# Altium project WoodStove.PrjPCB (part 4 of 4)

## Sheet JTAG.SchDoc
size Letter
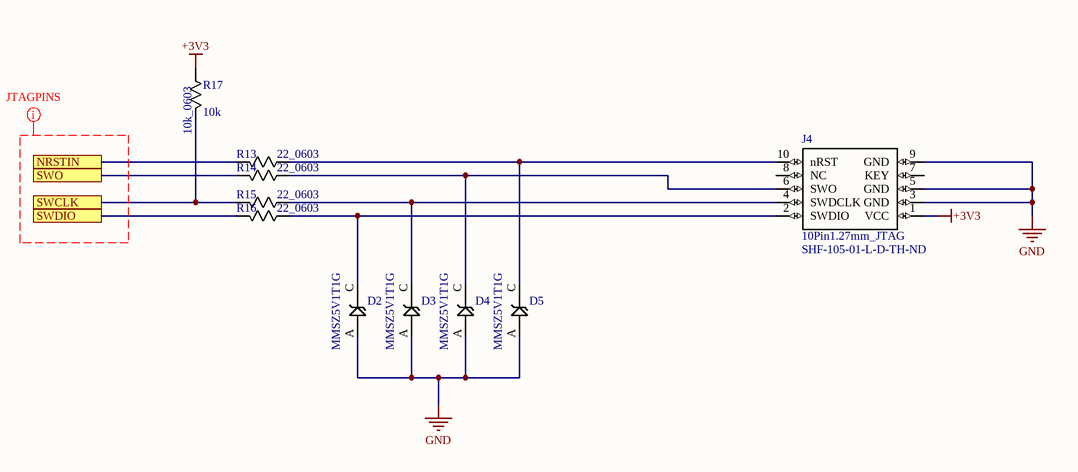
[diagram p9: JTAG.SchDoc]

### Parts
D2  MMSZ5V1T1G  [SOIC127P370X94-2N]
D3  MMSZ5V1T1G  [SOIC127P370X94-2N]
D4  MMSZ5V1T1G  [SOIC127P370X94-2N]
D5  MMSZ5V1T1G  [SOIC127P370X94-2N]
J4  10Pin1.27mm_JTAG  Supplier Part Number 1: SHF-105-01-L-D-TH-ND  [10Pin1.27mm]
R13  22_0603  [0603]
R14  22_0603  [0603]
R15  22_0603  [0603]
R16  22_0603  [0603]
R17  10k_0603  Resistance: 10k  [0603]

### Ports
NRSTIN, SWCLK, SWDIO, SWO

### Nets
+3V3: J4.1(VCC) R17.2
GND: D2.A D3.A D4.A D5.A J4.3(GND) J4.5(GND) J4.9(GND)
RSTNET: R13.1 ; port NRSTIN
NetD2_C: D2.C J4.2(SWDIO) R16.2
NetD3_C: D3.C J4.4(SWDCLK) R15.2
NetD4_C: D4.C J4.6(SWO) R14.2
NetD5_C: D5.C J4.10(nRST) R13.2
NetR14_1: R14.1 ; port SWO
NetR15_1: R15.1 R17.1 ; port SWCLK
NetR16_1: R16.1 ; port SWDIO

Not connected (* = marked no-connect by the designer): J4 7(KEY) 8(NC)

### Layout directives
net class JTAGNETS: (no net found under the mark)

### Library data of the parts
D2-D5 = MMSZ5V1T1G: DIODE Zener 5.1V 500mw; Manufacturer: ON Semiconductor; Material: Plastic; Tolerance: 5%; Impedance: 60R; Max Reverse Leakage Current: 2uA; Test Current: 5mA; Element Configuration: Single; Forward Voltage: 900mV; Zener Current: 10mA; Breakdown Voltage: 5.36V; Supplier 1: Future Electronics; Manufacturer Part Number: MMSZ5V1T1G; Stock 1: 0; Case/Package: SOD-123-2; Number of Pins: 2; Min Operating Temperature: -55°C; Max Operating Temperature: 150°C; Package Quantity: 1; Max Power Dissipation: 500mW; Packaging: Tape and Reel; Zener Voltage: 5.1V; Power Dissipation: 500mW; Voltage Tolerance: 5%; Working Voltage: 5.1V; Peak Reverse Current: 2uA; Voltage Rating (DC): 5.1V; Power Rating: 500mW; Length: 2.69mm; Height: 1.12mm; Width: 1.6mm; Radiation Hardening: No; Lead Free: Lead Free; REACH SVHC: No SVHC; ComponentLink1URL: https://datasheet.ciiva.com/895/mmsz2v4t1-d-895025.pdf; ComponentLink1Description: https://datasheet.ciiva.com/895/mmsz2v4t1-d-895025.pdf; ComponentLink2URL: https://datasheet.ciiva.com/895/mmsz2v4t1-d-895026.pdf; ComponentLink2Description: https://datasheet.ciiva.com/895/mmsz2v4t1-d-895026.pdf; ComponentLink3URL: https://datasheet.ciiva.com/895/mmsz2v4t1-d-895027.pdf; ComponentLink3Description: https://datasheet.ciiva.com/895/mmsz2v4t1-d-895027.pdf; ComponentLink4URL: https://datasheet.ciiva.com/15142/getdatasheetpartid-72078-15142387.pdf; ComponentLink4Description: https://datasheet.ciiva.com/15142/getdatasheetpartid-72078-15142387.pdf; ComponentLink5URL: https://datasheet.ciiva.com/8346/mmsz2v4t1-d-8346086.pdf; ComponentLink5Description: https://datasheet.ciiva.com/8346/mmsz2v4t1-d-8346086.pdf; ComponentLink6URL: https://datasheet.ciiva.com/8026/78656-8026888.pdf; ComponentLink6Description: https://datasheet.ciiva.com/8026/78656-8026888.pdf; ComponentLink7URL: https://datasheet.ciiva.com/26092/mmsz2v4t1-d-26092696.pdf; ComponentLink7Description: https://datasheet.ciiva.com/26092/mmsz2v4t1-d-26092696.pdf; ComponentLink8URL: https://datasheet.ciiva.com/16542/mmsz2v4t1-d-16542073.pdf; ComponentLink8Description: https://datasheet.ciiva.com/16542/mmsz2v4t1-d-16542073.pdf; ComponentLink9URL: https://datasheet.ciiva.com/8026/78656-8026890.pdf; ComponentLink9Description: https://datasheet.ciiva.com/8026/78656-8026890.pdf; Supplier Part Number 1: MMSZ5V1T1G
J4 = 10Pin1.27mm_JTAG: Manufacturer: Samtec; Manufacturer Part Number: SHF-105-01-L-D-TH; Number of Contacts: 10; Gender: Male; Pitch: 1.27mm; Supplier 1: Digi-Key; Stock 1: 0; Contact Plating: Nickel,Gold; Contact Material: Bronze; Housing Colour: Black; Housing Material: Polymer; Min Operating Temperature: -55°C; Max Operating Temperature: 125°C; Number of Rows: 2; Termination: Solder; Packaging: Bulk; Orientation: Straight; Length: 12.7mm; Depth: 5.59mm; Radiation Hardening: No; REACH SVHC: No SVHC; ComponentLink1URL: https://datasheet.ciiva.com/9475/eshf-9475367.pdf; ComponentLink1Description: https://datasheet.ciiva.com/9475/eshf-9475367.pdf; ComponentLink2URL: https://datasheet.ciiva.com/22665/shf-22665879.pdf; ComponentLink2Description: https://datasheet.ciiva.com/22665/shf-22665879.pdf; ComponentLink3URL: https://datasheet.ciiva.com/6091/shf-6091993.pdf; ComponentLink3Description: https://datasheet.ciiva.com/6091/shf-6091993.pdf; ComponentLink4URL: https://datasheet.ciiva.com/16710/eshf-16710363.pdf; ComponentLink4Description: https://datasheet.ciiva.com/16710/eshf-16710363.pdf; ComponentLink5URL: https://datasheet.ciiva.com/23730/shf-1xx-01-x-d-xx-xx-mkt-23730878.pdf; ComponentLink5Description: https://datasheet.ciiva.com/23730/shf-1xx-01-x-d-xx-xx-mkt-23730878.pdf
R13-R16 = 22_0603: Manufacturer: Vishay; Manufacturer Part Number: CRCW060322R0FKEA; Tolerance: 1%; Resistance: 22R; Voltage Rating: 75V; Temperature Coefficient: 100ppm/°C; Power Rating: 100mW; Supplier 1: Digi-Key; Stock 1: 0; Pricing 1: 5000=0.00497, 10000=0.00432, 25000=0.00405 (USD); Mount: Surface Mount; Case/Package: 0603; Weight: 7.1E-05oz; Case Code (Imperial): 0603; Case Code (Metric): 1608; Contact Plating: Tin,Lead; Min Operating Temperature: -55°C; Max Operating Temperature: 155°C; Packaging: Tape and Reel; Termination: SMD/SMT; Package Quantity: 5000; Military Standard: Not; Composition: Thick Film; Voltage Rating (DC): 75V; Length: 1.55mm; Height: 0.45mm; Width: 0.85mm; Depth: 0.85mm; Radiation Hardening: No; REACH SVHC: Unknown; Lead Free: Lead Free; ComponentLink1URL: https://datasheet.ciiva.com/16382/dcrcwe3-16382261.pdf; ComponentLink1Description: https://datasheet.ciiva.com/16382/dcrcwe3-16382261.pdf; ComponentLink2URL: https://datasheet.ciiva.com/5552/dcrcwe3-109170-5552120.pdf; ComponentLink2Description: https://datasheet.ciiva.com/5552/dcrcwe3-109170-5552120.pdf; ComponentLink3URL: https://datasheet.ciiva.com/22700/1697337-22700361.pdf; ComponentLink3Description: https://datasheet.ciiva.com/22700/1697337-22700361.pdf; ComponentLink4URL: https://datasheet.ciiva.com/11809/0900766b80d98afc-11809067.pdf; ComponentLink4Description: https://datasheet.ciiva.com/11809/0900766b80d98afc-11809067.pdf; ComponentLink5URL: https://datasheet.ciiva.com/7672/1697337-7672876.pdf; ComponentLink5Description: https://datasheet.ciiva.com/7672/1697337-7672876.pdf; ComponentLink6URL: https://datasheet.ciiva.com/15159/getdatasheetpartid-33090-15159388.pdf; ComponentLink6Description: https://datasheet.ciiva.com/15159/getdatasheetpartid-33090-15159388.pdf; ComponentLink7URL: https://datasheet.ciiva.com/7672/1697337-7672877.pdf; ComponentLink7Description: https://datasheet.ciiva.com/7672/1697337-7672877.pdf; ComponentLink8URL: https://datasheet.ciiva.com/26316/fld-crcw-e3-data-en-26316590.pdf; ComponentLink8Description: https://datasheet.ciiva.com/26316/fld-crcw-e3-data-en-26316590.pdf; ComponentLink9URL: https://datasheet.ciiva.com/16893/dcrcw-16893903.pdf; ComponentLink9Description: https://datasheet.ciiva.com/16893/dcrcw-16893903.pdf; Supplier Part Number 1: 541-22.0HTR-ND
R17 = 10k_0603: Manufacturer: Panasonic; Manufacturer Part Number: ERJ-3EKF1002V; Tolerance: 1%; Max Power Dissipation: 100mW; Temperature Coefficient: 100ppm/°C; Voltage Rating: 75V; Supplier 1: Digi-Key; Stock 1: 0; Pricing 1: 5000=0.00751, 10000=0.00653, 25000=0.00573, 50000=0.00526, 125000=0.00515 (USD); Mount: Surface Mount; Case/Package: 0603; Number of Pins: 2; Case Code (Metric): 1608; Case Code (Imperial): 0603; Contact Plating: Tin; Min Operating Temperature: -55°C; Max Operating Temperature: 155°C; Packaging: Tape and Reel; Power Rating: 100mW; Package Quantity: 1; Termination: SMD/SMT; Composition: Thick Film; Number of Terminations: 2; Military Standard: Not; Voltage Rating (DC): 75V; Length: 1.6mm; Height: 0.45mm; Depth: 0.8mm; Width: 0.031inch; Radiation Hardening: No; Lead Free: Lead Free; REACH SVHC: No SVHC; ComponentLink1URL: https://datasheet.ciiva.com/16511/aoa0000ce2-16511861.pdf; ComponentLink1Description: https://datasheet.ciiva.com/16511/aoa0000ce2-16511861.pdf; ComponentLink2URL: https://datasheet.ciiva.com/46372/1678782-46372725.pdf; ComponentLink2Description: https://datasheet.ciiva.com/46372/1678782-46372725.pdf; ComponentLink3URL: https://datasheet.ciiva.com/28514/426256-28514198.pdf; ComponentLink3Description: https://datasheet.ciiva.com/28514/426256-28514198.pdf; ComponentLink4URL: https://datasheet.ciiva.com/9194/aoa0000ce2-9194199.pdf; ComponentLink4Description: https://datasheet.ciiva.com/9194/aoa0000ce2-9194199.pdf; ComponentLink5URL: https://datasheet.ciiva.com/7830/aoa0000ce2-7830729.pdf; ComponentLink5Description: https://datasheet.ciiva.com/7830/aoa0000ce2-7830729.pdf; ComponentLink6URL: https://datasheet.ciiva.com/17212/aoa0000ce2-17212105.pdf; ComponentLink6Description: https://datasheet.ciiva.com/17212/aoa0000ce2-17212105.pdf; ComponentLink7URL: https://datasheet.ciiva.com/30208/aoa0000ce2-30208985.pdf; ComponentLink7Description: https://datasheet.ciiva.com/30208/aoa0000ce2-30208985.pdf; ComponentLink8URL: https://datasheet.ciiva.com/48530/aoa0000ce2-48530988.pdf; ComponentLink8Description: https://datasheet.ciiva.com/48530/aoa0000ce2-48530988.pdf; ComponentLink9URL: https://datasheet.ciiva.com/24070/aoa0000ce2-24070318.pdf; ComponentLink9Description: https://datasheet.ciiva.com/24070/aoa0000ce2-24070318.pdf; ComponentLink10URL: https://datasheet.ciiva.com/16759/70260748-16759807.pdf; ComponentLink10Description: https://datasheet.ciiva.com/16759/70260748-16759807.pdf; Supplier Part Number 1: P10.0KHTR-ND

## Nets that join several sheets
+3V3: RFDesign (5 pins), Thermocouple (8 pins), InductiveSensor (R10.2 R11.1), LightRelay (R22.2), PressureSensor (R35.2 R36.2), FanPWM (R8.1), Power (15 pins), MCU (15 pins), JTAG (J4.1 R17.2)
+5V: PressureSensor (6 pins), Power (9 pins)
+12V: InductiveSensor (J3.1 Q3.3), Power (14 pins)
GND: RFDesign (30 pins), Thermocouple (8 pins), InductiveSensor (J3.3 U8.2 U8.3), LightRelay (Q4.2), PressureSensor (7 pins), FanPWM (Q2.2), USB (J9.5 R39.1 U18.2), Power (32 pins), MCU (19 pins), JTAG (7 pins)
NetD1_1: InductiveSensor (D1.1 R10.1 U8.4), MCU (U12.19)
NetQ2_1: FanPWM (Q2.1), MCU (U12.22)
NetQ4_1: LightRelay (Q4.1), MCU (U12.25)
NetR2_2: RFDesign (R2.2), MCU (U12.10)
NetR4_1: RFDesign (R4.1 U1.14), MCU (U12.12)
NetR5_1: RFDesign (R5.1 U1.15), MCU (U12.11)
NetR14_1: MCU (U12.39), JTAG (R14.1)
NetR15_1: MCU (U12.37), JTAG (R15.1 R17.1)
NetR16_1: MCU (U12.34), JTAG (R16.1)
NetR35_1: PressureSensor (R35.1 U15.3), MCU (U12.30)
NetR36_1: PressureSensor (R36.1 U15.4), MCU (U12.31)
NetR37_1: Thermocouple (R37.1 U16.6), MCU (U12.40)
NetR38_1: Thermocouple (R38.1 U17.6), MCU (U12.41)
NetU1_16: RFDesign (U1.16), MCU (U12.16)
NetU1_17: RFDesign (U1.17), MCU (U12.17)
NetU1_18: RFDesign (U1.18), MCU (U12.15)
NetU1_21: RFDesign (U1.21), MCU (U12.2)
NetU1_22: RFDesign (U1.22), MCU (U12.46)
NetU1_23: RFDesign (U1.23), MCU (U12.45)
NetU12_21: Thermocouple (U16.5 U17.5), MCU (U12.21)
NetU12_27: Thermocouple (U16.7 U17.7), MCU (U12.27)
RSTNET: MCU (C13.1 R24.1 U12.7), JTAG (R13.1)
USB_N: USB (U18.1), MCU (U12.32)
USB_P: USB (U18.6), MCU (U12.33)